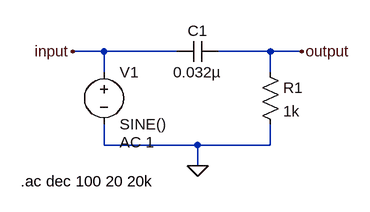
[diagram p0: schematic high-pass-filter.asc]
high-pass-filter.asc, the LTspice schematic file:
Version 4
SHEET 1 880 680
WIRE 48 80 0 80
WIRE 160 80 48 80
WIRE 304 80 224 80
WIRE 352 80 304 80
WIRE 48 112 48 80
WIRE 304 112 304 80
WIRE 48 224 48 192
WIRE 192 224 48 224
WIRE 304 224 304 192
WIRE 304 224 192 224
WIRE 192 256 192 224
FLAG 192 256 0
FLAG 0 80 input
FLAG 352 80 output
SYMBOL voltage 48 96 R0
WINDOW 123 24 124 Left 2
WINDOW 39 0 0 Left 0
SYMATTR Value2 AC 1
SYMATTR InstName V1
SYMATTR Value SINE()
SYMBOL cap 224 64 R90
WINDOW 0 0 32 VBottom 2
WINDOW 3 32 32 VTop 2
SYMATTR InstName C1
SYMATTR Value 0.032µ
SYMBOL res 288 96 R0
SYMATTR InstName R1
SYMATTR Value 1k
TEXT -80 280 Left 2 !.ac dec 100 20 20k

The netlist it stands for:
* high-pass-filter.asc
V1 input 0 SINE() AC 1
C1 output input 0.032µ
R1 output 0 1k
.ac dec 100 20 20k
.backanno
.end

* Results of the author's LTspice run, read from the files saved beside the schematic
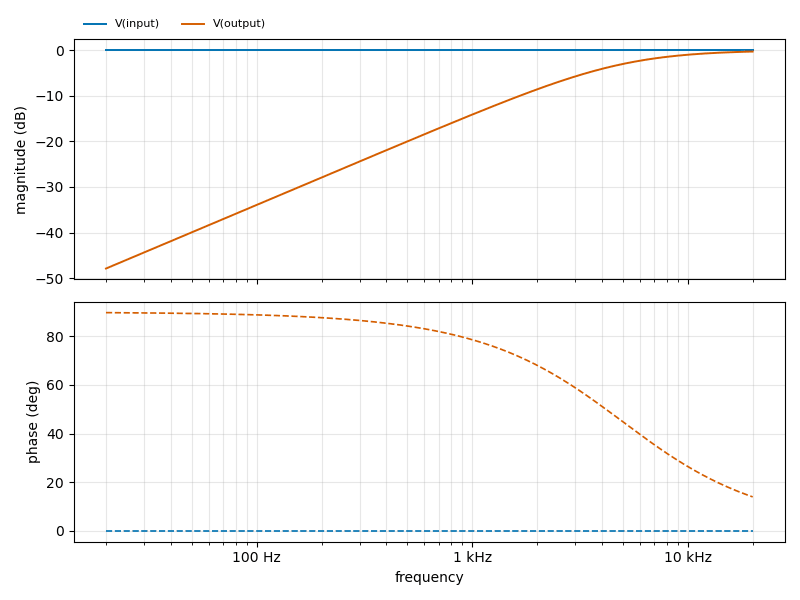
[diagram p1: AC Analysis of high-pass-filter.asc, plotted from the saved traces]
* AC Analysis, 1 run:
*   V(input): 0.00 dB at 20 Hz, 0.00 dB at 20 kHz, peak 0.00 dB at 20 Hz
*   V(output): -47.91 dB at 20 Hz, -0.26 dB at 20 kHz, peak -0.26 dB at 20 kHz, 3 dB below the peak at 4.692 kHz